# Altium schematic sheet Ethernet_PHY.SchDoc: Ethernet PHY
size A4; Revision: 1
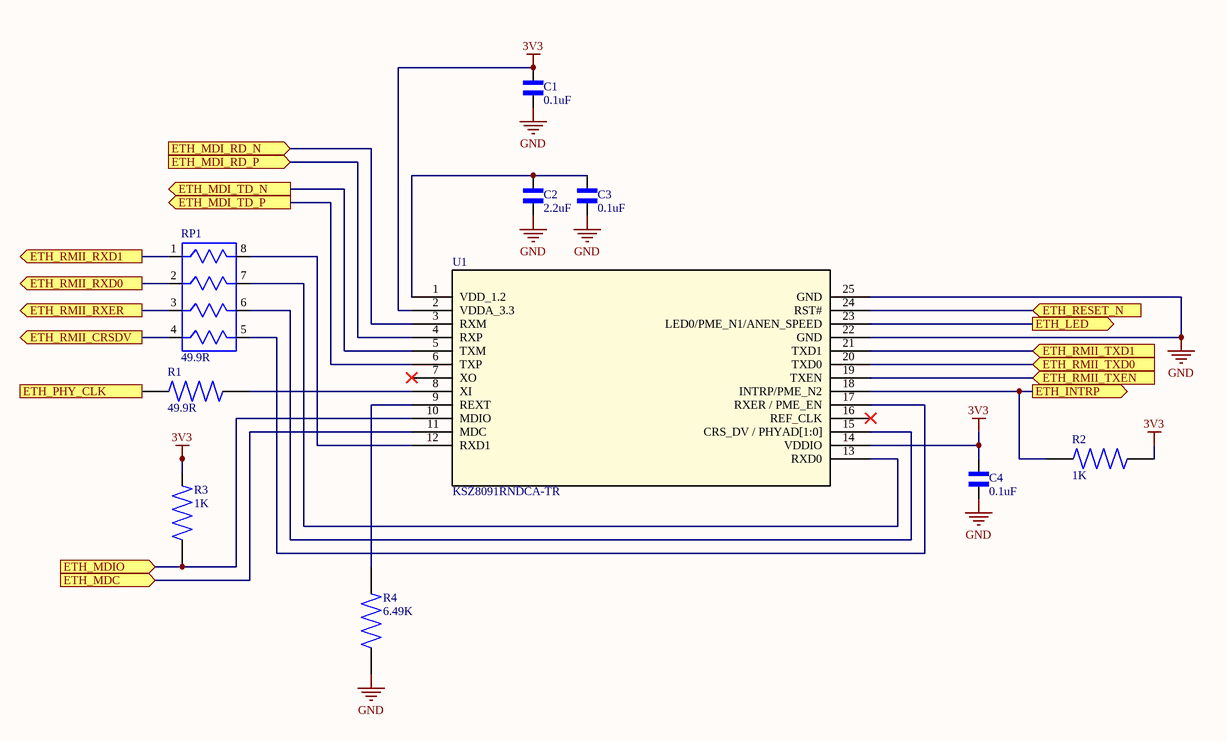
[diagram p0: Ethernet_PHY.SchDoc]

## Parts
C1  0.1uF  [C0402]
C2  2.2uF  [C0603]
C3  0.1uF  [C0402]
C4  0.1uF  [C0402]
R1  49.9R  [R0402 Vishay]
R2  1K  [R0603 Vishay]
R3  1K  [R0603 Vishay]
R4  6.49K  [R0603 Vishay]
RP1  49.9R  [RESCAXS50P200X100X55-8N]
U1  KSZ8091RNDCA-TR  [QFN50P400X400X90-25N]

## Ports
ETH_INTRP (out), ETH_LED (out), ETH_MDC (in), ETH_MDI_RD_N (in), ETH_MDI_RD_P (in), ETH_MDI_TD_N (out), ETH_MDI_TD_P (out), ETH_MDIO (in), ETH_PHY_CLK (in), ETH_RESET_N (in), ETH_RMII_CRSDV (out), ETH_RMII_RXD0 (out), ETH_RMII_RXD1 (out), ETH_RMII_RXER (out), ETH_RMII_TXD0 (in), ETH_RMII_TXD1 (in), ETH_RMII_TXEN (in)

## Nets
3V3: C1.2 C4.2 R2.1 R3.2 U1.2(VDDA_3.3) U1.14(VDDIO)
GND: C1.1 C2.1 C3.1 C4.1 R4.1 U1.22(GND) U1.25(GND)
ETH_INTRP: R2.2 U1.18(INTRP/PME_N2) ; port ETH_INTRP
ETH_LED: U1.23(LED0/PME_N1/ANEN_SPEED) ; port ETH_LED
ETH_MDC: U1.11(MDC) ; port ETH_MDC
ETH_MDI_RD_N: U1.3(RXM) ; port ETH_MDI_RD_N
ETH_MDI_RD_P: U1.4(RXP) ; port ETH_MDI_RD_P
ETH_MDI_TD_N: U1.5(TXM) ; port ETH_MDI_TD_N
ETH_MDI_TD_P: U1.6(TXP) ; port ETH_MDI_TD_P
ETH_MDIO: R3.1 U1.10(MDIO) ; port ETH_MDIO
ETH_PHY_CLK: R1.1 ; port ETH_PHY_CLK
ETH_RESET_N: U1.24(RST#) ; port ETH_RESET_N
ETH_RMII_CRSDV: RP1.4 ; port ETH_RMII_CRSDV
ETH_RMII_RXD0: RP1.2 ; port ETH_RMII_RXD0
ETH_RMII_RXD1: RP1.1 ; port ETH_RMII_RXD1
ETH_RMII_RXER: RP1.3 ; port ETH_RMII_RXER
ETH_RMII_TXD0: U1.20(TXD0) ; port ETH_RMII_TXD0
ETH_RMII_TXD1: U1.21(TXD1) ; port ETH_RMII_TXD1
ETH_RMII_TXEN: U1.19(TXEN) ; port ETH_RMII_TXEN
NetC2_2: C2.2 C3.2 U1.1(VDD_1.2)
NetR1_2: R1.2 U1.8(XI)
NetR4_2: R4.2 U1.9(REXT)
NetRP1_5: RP1.5 U1.17(RXER_/_PME_EN)
NetRP1_6: RP1.6 U1.15(CRS_DV_/_PHYAD[1:0])
NetRP1_7: RP1.7 U1.13(RXD0)
NetRP1_8: RP1.8 U1.12(RXD1)

Not connected (* = marked no-connect by the designer): U1 7(XO)* 16(REF_CLK)*

## Library data of the parts
C1 C3 C4 = GRM022R60J104KE15L: CAP CER 0.1UF 6.3V X5R 01005; Manufacturer: Murata; Capacitance: 100nF; Tolerance: 10%; Supplier 1: Digi-Key; Manufacturer Part Number: GRM022R60J104KE15L; RoHS: No; Category: Ceramic Capacitors; Stock 1: 633064; Pricing 1: 1=0.13000, 10=0.09000, 50=0.05080, 100=0.04210, 500=0.02952, 1000=0.02444, 2500=0.02275, 5000=0.02081 (USD); Mount: Surface Mount; Case Code (Imperial): 1005; Case Code (Metric): 0402; Min Operating Temperature: -55°C; Max Operating Temperature: 85°C; Packaging: Cut Tape; Voltage Rating: 6.3V; ComponentLink1URL: http://search.murata.co.jp/Ceramy/image/img/A01X/G101/ENG/GRM022R60J104KE15-01.pdf?src-supplier=Digi-Key; ComponentLink1Description: http://search.murata.co.jp/Ceramy/image/img/A01X/G101/ENG/GRM022R60J104KE15-01.pdf?src-supplier=Digi-Key; Supplier Part Number 1: 490-16598-1-ND
C2 = LMK107BJ225KK-T: Cap Ceramic 2.2uF 10V X5R 10% Pad SMD 0603 85C T/R; Manufacturer: Taiyo Yuden; Supplier 1: Digi-Key; Manufacturer Part Number: LMK107BJ225KK-T; RoHS: No; Category: Ceramic Capacitors; Stock 1: 4228; Pricing 1: 1=0.17000, 10=0.11900, 50=0.06760, 100=0.05600, 500=0.03926, 1000=0.03250 (USD); ComponentLink1URL: http://www.farnell.com/datasheets/2801359.pdf?src-supplier=Newark; ComponentLink1Description: http://www.farnell.com/datasheets/2801359.pdf?src-supplier=Newark; Supplier Part Number 1: 587-6290-1-ND
R1 = CRCW040249R9FKTD: RES SMD 49.9 OHM 1% 1/16W 0402; Manufacturer: Vishay; Power Rating: 63mW; Temperature Coefficient: 100ppm/°C; Voltage Rating: 50V; Supplier 1: Digi-Key; Manufacturer Part Number: CRCW040249R9FKTD; RoHS: Yes; Category: Chip SMD Resistors; Stock 1: 2971; Pricing 1: 1=0.12000, 10=0.10900, 100=0.04200, 1000=0.01848, 2500=0.01596, 5000=0.01428 (USD); Case/Package: 0402; Contact Plating: Tin,Lead; Weight: 2.3E-05oz; Case Code (Metric): 1005; Case Code (Imperial): 0402; Min Operating Temperature: -55°C; Max Operating Temperature: 155°C; Resistance: 49.9R; Tolerance: 1%; Resistor Type: Thick Film; Packaging: Tape and Reel; Package Quantity: 10000; Number of Terminations: 2; Max Power Dissipation: 63mW; Voltage Rating (DC): 50V; Features: Automotive AEC-Q200; Length: 1mm; Width: 0.02inch; Height: 0.016inch; Depth: 0.5mm; Radiation Hardening: No; Lead Free: Contains Lead; Military Standard: Not; REACH SVHC: Unknown; ComponentLink1URL: https://datasheet.ciiva.com/2563/dcrcw-2563534.pdf?src-supplier=Digi-Key; ComponentLink1Description: https://datasheet.ciiva.com/2563/dcrcw-2563534.pdf?src-supplier=Digi-Key; Supplier Part Number 1: 541-2963-1-ND
R2 R3 = CRCW02011K00FNED: Res Thick Film 0201 1K Ohm 1% 1/20W 200ppm/C Molded SMD SMD Paper T/R; Manufacturer: Vishay; Resistance: 1kR; Power Rating: 50mW; Voltage Rating: 30V; Temperature Coefficient: 200ppm/°C; Supplier 1: Digi-Key; Manufacturer Part Number: CRCW02011K00FNED; RoHS: Yes; Category: Chip SMD Resistors; Stock 1: 279214; Pricing 1: 1=0.10000, 10=0.05700, 100=0.02300, 1000=0.01034, 2500=0.00897, 5000=0.00741 (USD); Mount: Surface Mount; Case/Package: 0201; Number of Pins: 2; Weight: 6E-06oz; Case Code (Metric): 0603; Case Code (Imperial): 0201; Contact Plating: Tin; Min Operating Temperature: -55°C; Max Operating Temperature: 155°C; Packaging: Tape and Reel; Tolerance: 1%; Package Quantity: 1; Resistor Type: Thick Film; Number of Terminations: 2; Termination: SMD/SMT; Max Power Dissipation: 50mW; Voltage Rating (DC): 30V; Length: 0.6mm; Width: 0.012inch; Height: 0.011inch; Depth: 0.3mm; Radiation Hardening: No; REACH SVHC: Unknown; Military Standard: Not; Lead Free: Lead Free; ComponentLink1URL: https://datasheet.ciiva.com/2474/crcw0201e3-2474800.pdf?src-supplier=Digi-Key; ComponentLink1Description: https://datasheet.ciiva.com/2474/crcw0201e3-2474800.pdf?src-supplier=Digi-Key; ComponentLink2URL: https://datasheet.ciiva.com/2474/crcw0201e3-2474802.pdf?src-supplier=Digi-Key; ComponentLink2Description: https://datasheet.ciiva.com/2474/crcw0201e3-2474802.pdf?src-supplier=Digi-Key; ComponentLink3URL: https://datasheet.ciiva.com/22665/1825492-22665818.pdf?src-supplier=Element14; ComponentLink3Description: https://datasheet.ciiva.com/22665/1825492-22665818.pdf?src-supplier=Element14; ComponentLink4URL: https://datasheet.ciiva.com/7983/1719906-7983323.pdf?src-supplier=Element14; ComponentLink4Description: https://datasheet.ciiva.com/7983/1719906-7983323.pdf?src-supplier=Element14; ComponentLink5URL: https://datasheet.ciiva.com/7983/1719906-7983324.pdf?src-supplier=Element14; ComponentLink5Description: https://datasheet.ciiva.com/7983/1719906-7983324.pdf?src-supplier=Element14; ComponentLink6URL: https://datasheet.ciiva.com/2474/crcw0201e3-2474801.pdf?src-supplier=Digi-Key; ComponentLink6Description: https://datasheet.ciiva.com/2474/crcw0201e3-2474801.pdf?src-supplier=Digi-Key; ComponentLink7URL: https://datasheet.ciiva.com/3255/crcw0201e3-3255929.pdf?src-supplier=Avnet; ComponentLink7Description: https://datasheet.ciiva.com/3255/crcw0201e3-3255929.pdf?src-supplier=Avnet; ComponentLink8URL: https://datasheet.ciiva.com/22871/70202042-22871422.pdf?src-supplier=Allied+Electronics; ComponentLink8Description: https://datasheet.ciiva.com/22871/70202042-22871422.pdf?src-supplier=Allied+Electronics; ComponentLink9URL: https://datasheet.ciiva.com/22692/1719906-22692751.pdf?src-supplier=Element14; ComponentLink9Description: https://datasheet.ciiva.com/22692/1719906-22692751.pdf?src-supplier=Element14; Supplier Part Number 1: 541-1.00KABCT-ND
R4 = CRCW02016K49FNED: RES SMD 6.49K OHM 1% 1/20W 0201; Manufacturer: Vishay; Power Rating: 50mW; Voltage Rating: 30V; Resistance: 6.49kR; Temperature Coefficient: 200ppm/°C; Supplier 1: Digi-Key; Manufacturer Part Number: CRCW02016K49FNED; RoHS: Yes; Category: Chip SMD Resistors; Stock 1: 4970; Pricing 1: 1=0.10000, 10=0.05700, 100=0.02300, 1000=0.01034, 2500=0.00897, 5000=0.00741 (USD); Case/Package: 0201; Case Code (Metric): 0603; Case Code (Imperial): 0201; Contact Plating: Tin; Min Operating Temperature: -55°C; Max Operating Temperature: 155°C; Tolerance: 1%; Packaging: Cut Tape; Resistor Type: Thick Film; Voltage Rating (DC): 30V; Length: 600um; Width: 300um; Height: 230um; REACH SVHC: Unknown; Lead Free: Lead Free; ComponentLink1URL: https://datasheet.ciiva.com/22684/1700795-22684054.pdf?src-supplier=Element14; ComponentLink1Description: https://datasheet.ciiva.com/22684/1700795-22684054.pdf?src-supplier=Element14; ComponentLink2URL: https://datasheet.ciiva.com/9062/crcw0201e3-9062251.pdf?src-supplier=Avnet; ComponentLink2Description: https://datasheet.ciiva.com/9062/crcw0201e3-9062251.pdf?src-supplier=Avnet; Supplier Part Number 1: 541-CRCW02016K49FNEDCT-ND
RP1 = YC124-FR-0749R9L: Res Thick Film Array 49.9 Ohm 1% 200ppm/C ISOL Molded 8-Pin 0804(4 X 0402) Convex SMD Paper T/R; Manufacturer: Yageo; Number of Terminals/Pins: 8; Temperature Coefficient: 200ppm/°C; Number of Resistors: 4; Circuit Type: Isolated; Power Per Element: 62.5mW; Working Voltage: 50V; Supplier 1: Digi-Key; Manufacturer Part Number: YC124-FR-0749R9L; RoHS: Yes; Category: Resistor Arrays; Stock 1: 76594; Pricing 1: 1=0.35000, 10=0.29700, 25=0.21560, 50=0.15640, 100=0.11590, 250=0.08896, 500=0.07010, 1000=0.04853, 5000=0.04044 (USD); Mount: Surface Mount; Case/Package: 0402; Number of Pins: 8; Min Operating Temperature: -55°C; Max Operating Temperature: 155°C; Resistance: 49.9R; Termination: Convex; Power Dissipation: 62.5mW; Number of Elements: 4; Tolerance: 1%; Package Quantity: 1; Packaging: Tape and Reel; Number of Circuits: 4; Length: 0.079inch; Width: 0.039inch; Height: 0.022inch; Terminal Pitch: 0.5mm; Depth: 1mm; Radiation Hardening: No; Military Standard: Not; Lead Free: Lead Free; ComponentLink1URL: https://datasheet.ciiva.com/2689/pyu-yc-tc124-51-rohs-l-3-2689456.pdf?src-supplier=Digi-Key; ComponentLink1Description: https://datasheet.ciiva.com/2689/pyu-yc-tc124-51-rohs-l-3-2689456.pdf?src-supplier=Digi-Key; ComponentLink2URL: https://datasheet.ciiva.com/28381/pyu-yc-tc124-51-rohs-l-2-28381383.pdf?src-supplier=Avnet+Europe; ComponentLink2Description: https://datasheet.ciiva.com/28381/pyu-yc-tc124-51-rohs-l-2-28381383.pdf?src-supplier=Avnet+Europe; ComponentLink3URL: https://datasheet.ciiva.com/16961/pyu-yc-tc124-51-rohs-l-2-16961496.pdf?src-supplier=Avnet+Europe; ComponentLink3Description: https://datasheet.ciiva.com/16961/pyu-yc-tc124-51-rohs-l-2-16961496.pdf?src-supplier=Avnet+Europe; ComponentLink4URL: https://datasheet.ciiva.com/17470/pyu-yc-tc124-51-rohs-l-3-17470984.pdf?src-supplier=Future+Electronics; ComponentLink4Description: https://datasheet.ciiva.com/17470/pyu-yc-tc124-51-rohs-l-3-17470984.pdf?src-supplier=Future+Electronics; ComponentLink5URL: https://datasheet.ciiva.com/2689/pyu-yc-tc124-51-rohs-l-3-2689454.pdf?src-supplier=Digi-Key; ComponentLink5Description: https://datasheet.ciiva.com/2689/pyu-yc-tc124-51-rohs-l-3-2689454.pdf?src-supplier=Digi-Key; ComponentLink6URL: https://datasheet.ciiva.com/2689/pyu-yc-tc124-51-rohs-l-3-2689455.pdf?src-supplier=Digi-Key; ComponentLink6Description: https://datasheet.ciiva.com/2689/pyu-yc-tc124-51-rohs-l-3-2689455.pdf?src-supplier=Digi-Key; ComponentLink7URL: https://datasheet.ciiva.com/8311/pyu-yc-tc124-51-rohs-l-2-8311759.pdf?src-supplier=Avnet; ComponentLink7Description: https://datasheet.ciiva.com/8311/pyu-yc-tc124-51-rohs-l-2-8311759.pdf?src-supplier=Avnet; Supplier Part Number 1: YC124F-49.9CT-ND
U1 = KSZ8091RNDCA-TR: 10/100 Base-Tx Physical Layer Transceiver, Eee, Wol / 24 Vqfn 4X4X0.9Mm T/r; Vendor: Microchip; Built_By: EMA_Cory; SourceLibrary: Microchip_2020-10-12; Datasheet: https://ww1.microchip.com/downloads/en/DeviceDoc/00002298A.pdf; Manufacturer_Part_Number: KSZ8091RNDCA-TR; Copyright: Copyright (C) 2018 Accelerated Designs. All rights reserved; RefDes: RefDes; Type: DEV